# Altium project PCB3_Lab3PrjPcb.PrjPcb
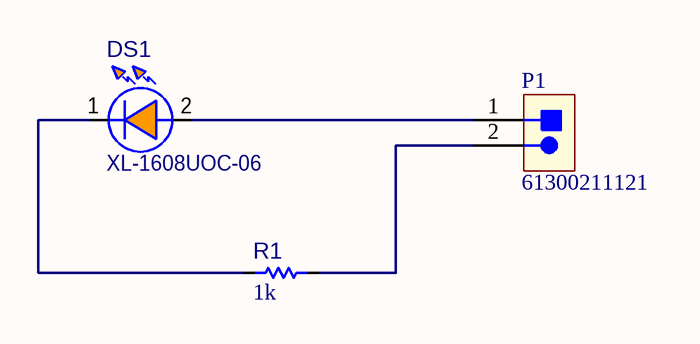
[diagram p0: Sheet1.SchDoc]
NomDeLetudiant: Le nom de l'étudiant; NomDeProjet: Le nom de mon Projet; Revision: La Revision
1 sheet, 3 parts. Net scope: global (net labels, ports and power ports of the same name join across sheets).
Board file: Pcb1.PcbDoc

## Sheet Sheet1.SchDoc: TITRE
size Letter; ApprovedBy: APPROUVÉ PAR; Author: Le nom de l'étudiant; Organization: Cegep Limoilou; Address1: 1300, 8e Avenue; Address2: Québec, QC; Address3: Canada; Address4: G1J 5L5; SheetNumber: 1; SheetTotal: 1

### Parts
DS1  XL-1608UOC-06  [D_LED_0603]
P1  61300211121  [CONN_HDR_2POS_100MILS_TH]
R1  value 1k  [R_1608[0603]]  (hidden comment: Res 1k 1% 0603)

### Nets
NetDS1_1: DS1.1(K) R1.1
NetDS1_2: DS1.2(A) P1.1
NetP1_2: P1.2 R1.2

### Notes on the sheet
- Titre :
- Conception :
- Date :
- Approbation :
- Heure :
- Révision :
- Feuille
- de
- Fichier :

### Library data of the parts
DS1 = D_LED_ORANGE_0603: LED Orange Clear; Manufacturer 1: XINGLIGHT; Code CEGEP: KLEDOC0603; Value: Orange; Manufacturer 2: Wurth; Manufacturer Part Number 1: XL-1608UOC-06; Manufacturer Part Number 2: 150060AS75000; Mounting Technology: SMT; Supplier 1: LCSC; Supplier 2: Digikey; Supplier Part Number 1: C965800; Supplier Part Number 2: 732-150060AS75000CT-ND
P1 = CONN-100MIL-HDR-01X02: CONN HEADER 2POS 100MIL; Manufacturer 1: Megastar; Manufacturer Part Number 1: ZX-PZ2.54-1-2PZZ; Mounting Technology: TH; Supplier 1: LCSC; Supplier Part Number 1: C7501260; Manufacturer 2: Würth Elektronik; Manufacturer Part Number 2: 61300211121
R1 = RES015: Resistor type 1; Manufacturer 1: Yageo; Manufacturer Part Number 1: RC0603FR-071KL; LibRef: RES015; Puissance: 1/10W; Max Working Voltage: 75V; Tolerance: 1%; Mounting Technology: SMT; Supplier 1: LCSC; Supplier Part Number 1: C22548